# Altium schematic sheet 无源高通.SchDoc
size A4
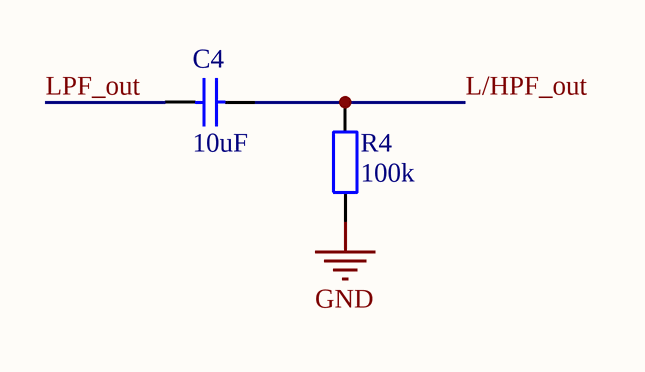
[diagram p0: 无源高通.SchDoc]

## Parts
C4  10uF  [LC-0805_C]
R4  100k  [LC-0805_R]

## Nets
GND: R4.1
L/HPF_out: C4.2 R4.2
LPF_out: C4.1

## Library data of the parts
C4 = Cap: 100nF��0805��50V,+/-10%
R4 = R: 10k��,0805,��5%